# EAGLE board MBot (EAGLE 6.2), part 1 of 2
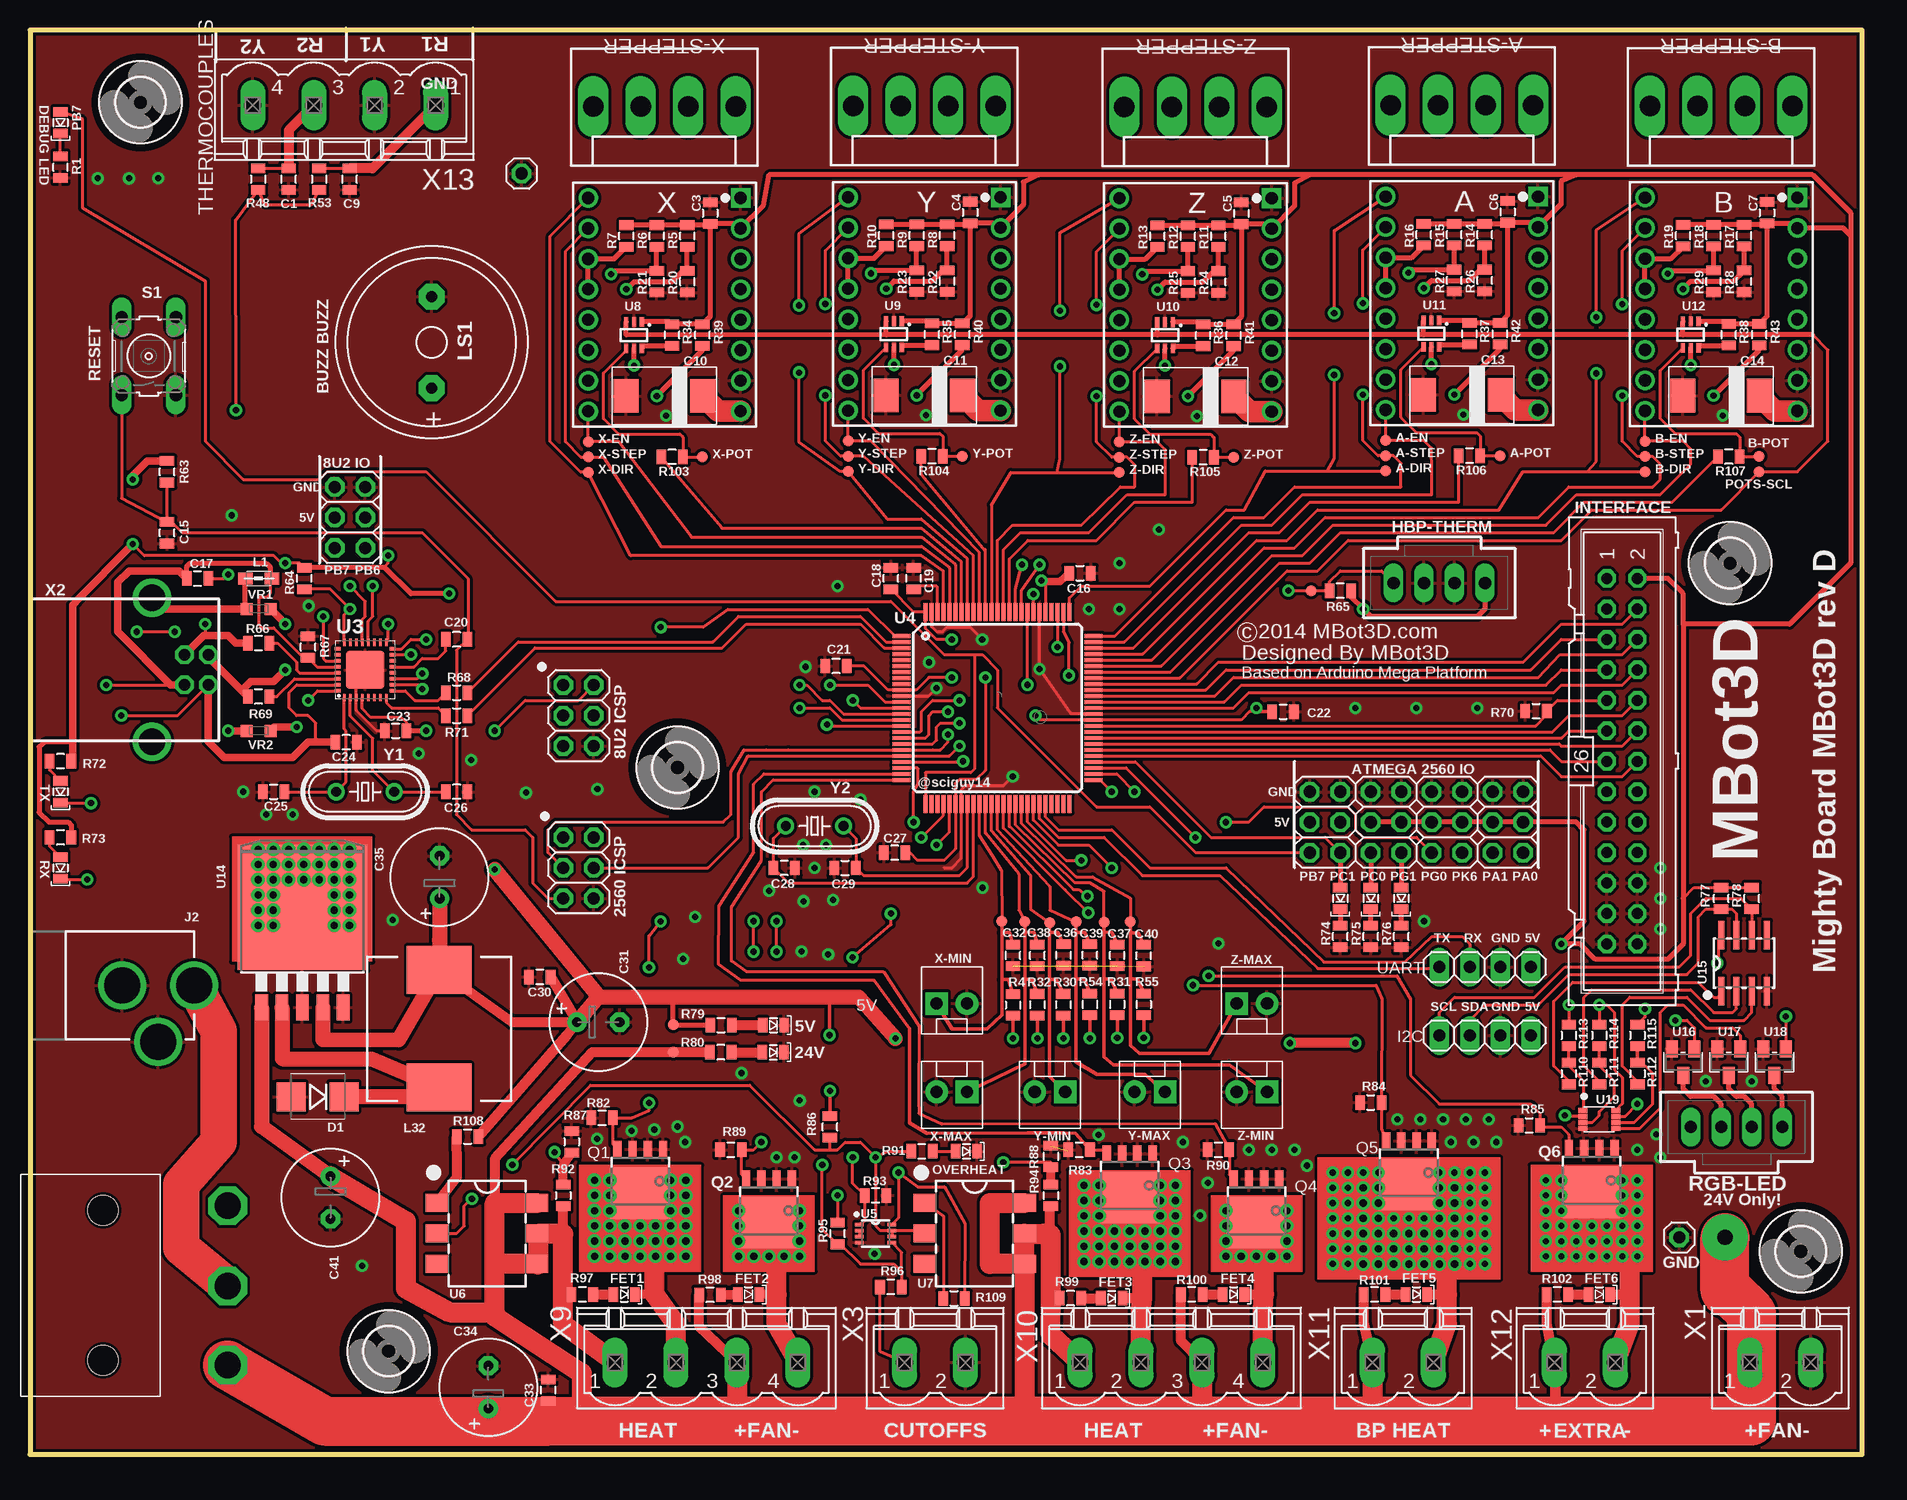
[diagram p2: board, top side]
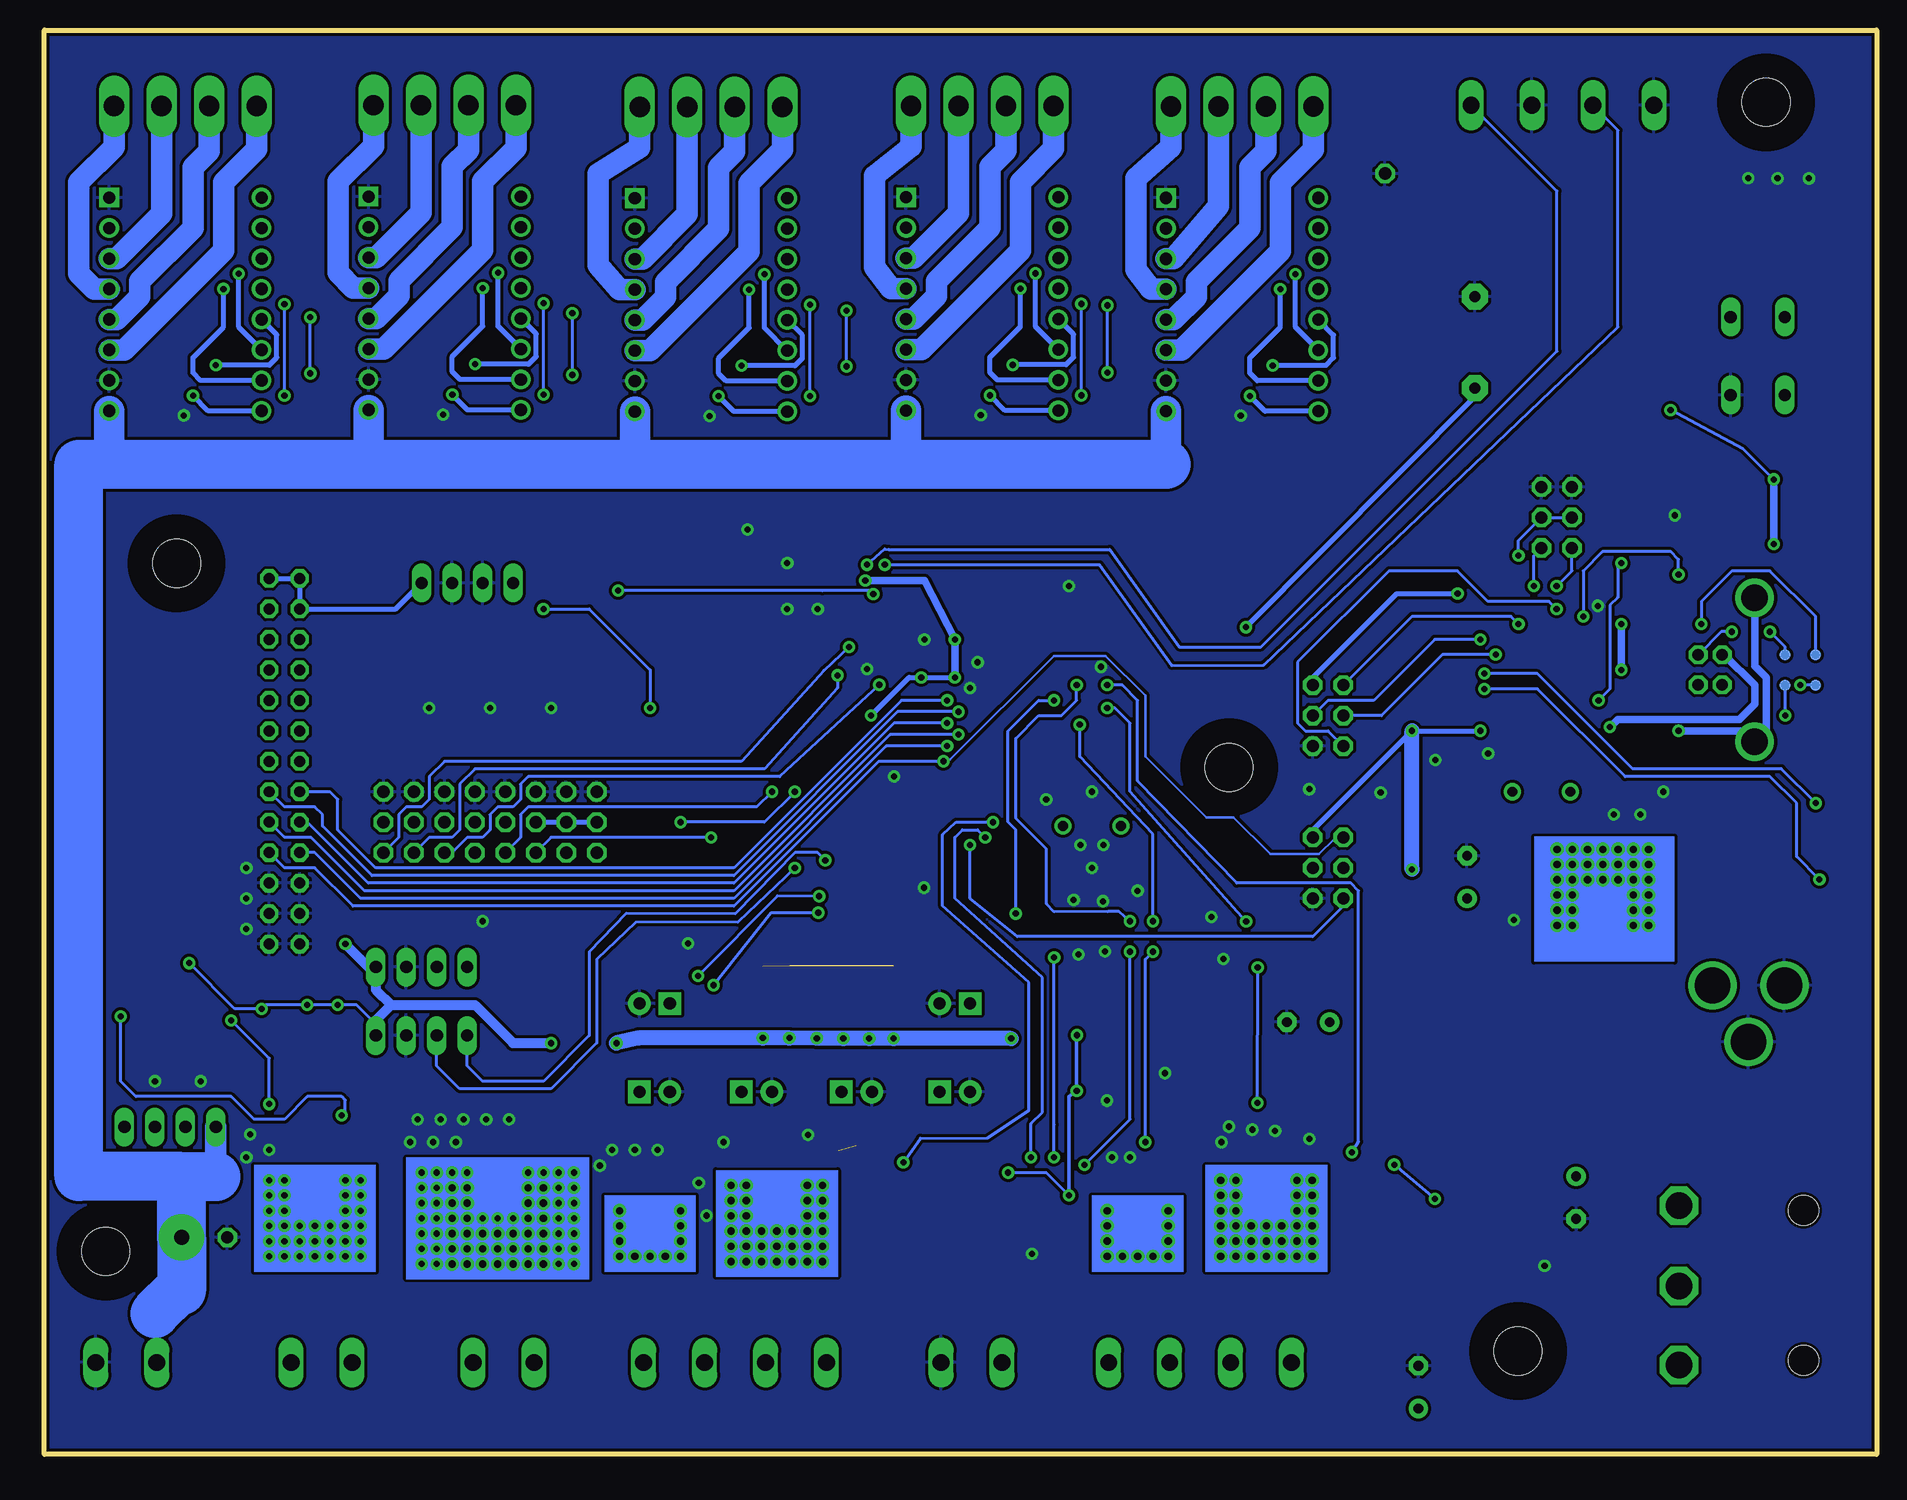
[diagram p3: board, bottom side, seen from below]

Size 152.72 x 118.75 mm. Coordinates in mm from the lower left corner, seen from the top.
Outline: 0,0 152.72,0 152.72,118.74 0,118.74 0,0
Copper layers (1*16): Top 0.035mm / dielectric 1.5mm / Bottom 0.035mm
Design rules: minimum track width 8mil, minimum drill 20mil, track to track 4mil, track to pad 4mil, pad to pad 4mil, via to via 4mil, smd to smd 0mil, copper to edge 10mil, drill to drill 8mil, minimum pad ring 12mil, minimum via ring 10mil, stop-mask expansion 4mil, vias tented up to drill 25mil, thermal gap 10mil
Net classes: 0 default: width 0.203 mm, drill 0.508 mm, clearance 0.203 mm; 1 24V: width 0.889 mm, drill 0.635 mm, clearance 0.508 mm; 2 gnd: width 0.381 mm, drill 0.508 mm, clearance 0.254 mm; 3 5V: width 0.381 mm, drill 0.508 mm, clearance 0.254 mm; 4 3.3V: width 0.381 mm, drill 0.508 mm, clearance 0.254 mm; 5 DC Motor: width 0.762 mm, drill 0.635 mm, clearance 0.254 mm

## Footprints (pad centres in the part's own frame; a part is rotated, then mirrored left to right if it is on the bottom)
LED-0805 = smd 1.2 x 0.8: A 0,-0.9; C 0,0.9
TP09R = smd 0.9 x 0.9: TP 0,0
KK-156-4 = drill 1.7 pad 2.184 long: 1 -5.94,0; 2 -1.98,0; 3 1.98,0; 4 5.94,0
BOTSTEP17-INV = drill 1.016 square: 1 6.35,8.89 | drill 1.016: 2 6.35,6.35; 3 6.35,3.81; 4 6.35,1.27; 5 6.35,-1.27; 6 6.35,-3.81; 7 6.35,-6.35; 8 6.35,-8.89; 9 -6.35,-8.89; 10 -6.35,-6.35; 11 -6.35,-3.81; 12 -6.35,-1.27; 13 -6.35,1.27; 14 -6.35,3.81; 15 -6.35,6.35; 16 -6.35,8.89
0805 = smd 0.8 x 1.2: 1 -0.9,0; 2 0.9,0
CAP2917 = smd 2.1 x 2.8: 1 -3.2,0; 2 3.2,0
E3,5-8 = drill 0.813 pad 1.6: + -1.778,0 | drill 0.813 pad 1.6 octagon: - 1.778,0
SMB-DIODE = smd 2.4 x 2.4: A 2.2,0; C -2.2,0
4,0HOLE-3,0KEEPOUT = hole 4: 0,0
70543-04 = drill 1.016 long: 1 -3.81,0; 2 -1.27,0; 3 1.27,0; 4 3.81,0
1X04 = drill 1.016 long: 1 -3.81,0; 2 -1.27,0; 3 1.27,0; 4 3.81,0
2X03 = drill 1.016 octagon: 1 -2.54,-1.27; 2 -2.54,1.27; 3 0,-1.27; 4 0,1.27; 5 2.54,-1.27; 6 2.54,1.27
ML26 = drill 0.914 octagon: 1 -15.24,-1.27; 2 -15.24,1.27; 3 -12.7,-1.27; 4 -12.7,1.27; 5 -10.16,-1.27; 6 -10.16,1.27; 7 -7.62,-1.27; 8 -7.62,1.27; 9 -5.08,-1.27; 10 -5.08,1.27; 11 -2.54,-1.27; 12 -2.54,1.27; 13 0,-1.27; 14 0,1.27; 15 2.54,-1.27; 16 2.54,1.27; 17 5.08,-1.27; 18 5.08,1.27; 19 7.62,-1.27; 20 7.62,1.27; 21 10.16,-1.27; 22 10.16,1.27; 23 12.7,-1.27; 24 12.7,1.27; 25 15.24,-1.27; 26 15.24,1.27
POWER_JACK_PTH = drill 2.997: GND 0,7.7; GNDBREAK 4.7,10.7; PWR 0,13.7
MOLEX-1X2 = drill 1.016 pad 1.88 square: 1 0,0 | drill 1.016 pad 1.88: 2 2.54,0
1X01 = drill 1.016 octagon: 1 0,0
0805' = smd 1.2 x 1: 1 -1.1,0; 2 1.1,0
CDRH125 = smd 5.4 x 4: 1 0,4.9; 2 0,-4.9
F/QMB = drill 0.914 pad 2.159 octagon: + 3.81,0; - -3.81,0
SOT669 = smd 0.7 x 1.4: 1 -1.905,-3.92; 2 -0.635,-3.92; 3 0.635,-3.92; 4 1.905,-3.92 | smd 5 x 4.3: MB 0,-0.27
B3F-10XX = drill 1.016 long: 1 -3.251,2.261; 2 3.251,2.261; 3 -3.251,-2.261; 4 3.251,-2.261
SWITCH = drill 2.2 octagon: P$3 2.6,17.24; P$4 9.3,17.24; P$5 15.9,17.24 | hole 2.5: 3,6.85; 15.491,6.85
QFN32 = smd 0.6 x 0.3: 1 -2.3,1.75; 2 -2.3,1.25; 3 -2.3,0.75; 4 -2.3,0.25; 5 -2.3,-0.25; 6 -2.3,-0.75; 7 -2.3,-1.25; 8 -2.3,-1.75; 17 2.3,-1.75; 18 2.3,-1.25; 19 2.3,-0.75; 20 2.3,-0.25; 21 2.3,0.25; 22 2.3,0.75; 23 2.3,1.25; 24 2.3,1.75 | smd 0.3 x 0.6: 9 -1.75,-2.3; 10 -1.25,-2.3; 11 -0.75,-2.3; 12 -0.25,-2.3; 13 0.25,-2.3; 14 0.75,-2.3; 15 1.25,-2.3; 16 1.75,-2.3; 25 1.75,2.3; 26 1.25,2.3; 27 0.75,2.3; 28 0.25,2.3; 29 -0.25,2.3; 30 -0.75,2.3; 31 -1.25,2.3; 32 -1.75,2.3 | smd 3.2 x 3.2: EXP 0,0
TQFP100 = smd 1.5 x 0.35: 1 -8,6; 2 -8,5.5; 3 -8,5; 4 -8,4.5; 5 -8,4; 6 -8,3.5; 7 -8,3; 8 -8,2.5; 9 -8,2; 10 -8,1.5; 11 -8,1; 12 -8,0.5; 13 -8,0; 14 -8,-0.5; 15 -8,-1; 16 -8,-1.5; 17 -8,-2; 18 -8,-2.5; 19 -8,-3; 20 -8,-3.5; 21 -8,-4; 22 -8,-4.5; 23 -8,-5; 24 -8,-5.5; 25 -8,-6; 51 8,-6; 52 8,-5.5; 53 8,-5; 54 8,-4.5; 55 8,-4; 56 8,-3.5; 57 8,-3; 58 8,-2.5; 59 8,-2; 60 8,-1.5; 61 8,-1; 62 8,-0.5; 63 8,0; 64 8,0.5; 65 8,1; 66 8,1.5; 67 8,2; 68 8,2.5; 69 8,3; 70 8,3.5; 71 8,4; 72 8,4.5; 73 8,5; 74 8,5.5; 75 8,6 | smd 0.35 x 1.5: 26 -6,-8; 27 -5.5,-8; 28 -5,-8; 29 -4.5,-8; 30 -4,-8; 31 -3.5,-8; 32 -3,-8; 33 -2.5,-8; 34 -2,-8; 35 -1.5,-8; 36 -1,-8; 37 -0.5,-8; 38 0,-8; 39 0.5,-8; 40 1,-8; 41 1.5,-8; 42 2,-8; 43 2.5,-8; 44 3,-8; 45 3.5,-8; 46 4,-8; 47 4.5,-8; 48 5,-8; 49 5.5,-8; 50 6,-8; 76 6,8; 77 5.5,8; 78 5,8; 79 4.5,8; 80 4,8; 81 3.5,8; 82 3,8; 83 2.5,8; 84 2,8; 85 1.5,8; 86 1,8; 87 0.5,8; 88 0,8; 89 -0.5,8; 90 -1,8; 91 -1.5,8; 92 -2,8; 93 -2.5,8; 94 -3,8; 95 -3.5,8; 96 -4,8; 97 -4.5,8; 98 -5,8; 99 -5.5,8; 100 -6,8
US8 = smd 0.3 x 0.7: 1 -0.75,-1.35; 2 -0.25,-1.35; 3 0.25,-1.35; 4 0.75,-1.35; 5 0.75,1.35; 6 0.25,1.35; 7 -0.25,1.35; 8 -0.75,1.35
AQV25-DIPSM = smd 1.5 x 1.9: 1 -2.54,-4.15; 2 0,-4.15; 3 2.54,-4.15; 4 2.54,4.15; 5 0,4.15; 6 -2.54,4.15
SC70-6L = smd 0.35 x 0.8: 1 -0.65,-1.1; 2 0,-1.1; 3 0.65,-1.1; 4 0.65,1.1; 5 0,1.1; 6 -0.65,1.1
TO263-5 = smd 1.067 x 2.159: 1 -3.404,-5.791; 2 -1.702,-5.791; 3 0,-5.791; 4 1.702,-5.791; 5 3.404,-5.791 | smd 10.8 x 10.41: 6 0,2.54
SO8 = smd 0.5 x 2.388: 1 -1.905,-2.324; 2 -0.635,-2.324; 3 0.635,-2.324; 4 1.905,-2.324; 5 1.905,2.324; 6 0.635,2.324; 7 -0.635,2.324; 8 -1.905,2.324
SOT-23 = smd 1 x 1.4: 1 -0.95,-1.1; 2 0.95,-1.1; 3 0,1.1
VSSOP8 = smd 0.4 x 0.75: 1 -0.75,-1.375; 2 -0.25,-1.375; 3 0.25,-1.375; 4 0.75,-1.375; 5 0.75,1.375; 6 0.25,1.375; 7 -0.25,1.375; 8 -0.75,1.375
CT/CN0603 = smd 1 x 1: 1 -1,0; 2 1,0
MSTBV2 = drill 1.397 long: 1 -2.54,0; 2 2.54,0
SMARTPRJ_PN61729 = drill 0.95 octagon: 1 1.25,4.71; 2 -1.25,4.71; 3 -1.25,2.71; 4 1.25,2.71 | drill 2.2: P$1 -6,0; P$2 6,0
MSTBV4 = drill 1.397 long: 1 -7.62,0; 2 -2.54,0; 3 2.54,0; 4 7.62,0
HC49/S = drill 0.813: 1 -2.413,0; 2 2.413,0

## Placement (x,y rotation side)
5V  GREEN  [LED-0805]  61.97,35.79 270 top
24V  GREEN  [LED-0805]  61.95,33.53 270 top
A-DIR  TPSQTP09R  [TP09R]  113,81.99 0 top
A-EN  TPSQTP09R  [TP09R]  113,84.53 0 top
A-POT  TPSQTP09R  [TP09R]  122.53,83.26 0 top
A-STEP  TPSQTP09R  [TP09R]  113,83.26 0 top
A-STEPPER  [KK-156-4]  119.35,112.47 180 top
B-DIR  TPSQTP09R  [TP09R]  134.62,81.92 0 top
B-EN  TPSQTP09R  [TP09R]  134.62,84.45 0 top
B-POT  TPSQTP09R  [TP09R]  144.14,83.19 0 top
B-STEP  TPSQTP09R  [TP09R]  134.62,83.19 0 top
B-STEPPER  [KK-156-4]  140.97,112.4 180 top
BOTSTEP-A  BOTSTEP17  [BOTSTEP17-INV]  119.35,95.96 0 top
BOTSTEP-B  BOTSTEP17  [BOTSTEP17-INV]  140.97,95.89 0 top
BOTSTEP-X  BOTSTEP17  [BOTSTEP17-INV]  52.88,95.86 0 top
BOTSTEP-Y  BOTSTEP17  [BOTSTEP17-INV]  74.55,95.91 0 top
BOTSTEP-Z  BOTSTEP17  [BOTSTEP17-INV]  97.16,95.83 0 top
C1  10uF  [0805]  21.56,106.31 90 top
C3  100nF  [0805]  56.69,103.48 270 top
C4  100nF  [0805]  78.36,103.53 270 top
C5  100nF  [0805]  100.97,103.45 270 top
C6  100nF  [0805]  123.16,103.58 270 top
C7  100nF  [0805]  144.78,103.51 270 top
C9  10uF  [0805]  26.64,106.31 90 top
C10  47uF  [CAP2917]  52.88,88.24 180 top
C11  47uF  [CAP2917]  74.55,88.29 180 top
C12  47uF  [CAP2917]  97.16,88.21 180 top
C13  47uF  [CAP2917]  119.35,88.34 180 top
C14  47uF  [CAP2917]  140.97,88.27 180 top
C15  22pF  [0805]  11.43,76.84 90 top
C16  100nF  [0805]  87.53,73.47 0 top
C17  1uF  [0805]  13.97,73.03 0 top
C18  100nF  [0805]  71.76,73.03 90 top
C19  100nF  [0805]  73.66,73.03 90 top
C20  100nF  [0805]  35.56,67.95 180 top
C21  100nF  [0805]  67.18,65.72 180 top
C22  100nF  [0805]  104.46,61.91 0 top
C23  100nF  [0805]  30.48,60.32 0 top
C24  100nF  [0805]  26.35,59.37 180 top
C25  22pF  [0805]  20.32,55.24 0 top
C26  22pF  [0805]  35.56,55.24 180 top
C27  100nF  [0805]  72.07,50.16 180 top
C28  22pF  [0805]  62.86,48.89 180 top
C29  22pF  [0805]  67.95,48.89 0 top
C30  100nF  [0805]  42.49,39.8 180 top
C31  100uF  [E3,5-8]  47.37,36.04 0 top
C32  100nF  [0805]  81.94,41.61 90 top
C33  100nF  [0805]  43.19,5.36 90 top
C34  100uF  [E3,5-8]  38.2,5.6 90 top
C35  220uF  [E3,5-8]  34.14,48.13 90 top
C36  100nF  [0805]  86.16,41.63 90 top
C37  100nF  [0805]  90.63,41.61 90 top
C38  100nF  [0805]  83.97,41.61 90 top
C39  100nF  [0805]  88.34,41.63 90 top
C40  100nF  [0805]  92.84,41.58 90 top
C41  680uF  [E3,5-8]  25.04,21.41 270 top
D1  [SMB-DIODE]  23.98,29.82 180 top
DEBUG1  GREEN  [LED-0805]  2.54,111.02 180 top
DEBUG2  GREEN  [LED-0805]  109.22,46.35 180 top
DEBUG3  GREEN  [LED-0805]  111.76,46.35 180 top
DEBUG4  GREEN  [LED-0805]  114.3,46.35 180 top
FET1  GREEN  [LED-0805]  49.53,13.33 270 top
FET2  GREEN  [LED-0805]  59.89,13.33 270 top
FET3  GREEN  [LED-0805]  90.17,13.03 270 top
FET4  GREEN  [LED-0805]  100.33,13.33 270 top
FET5  GREEN  [LED-0805]  115.57,13.33 270 top
FET6  GREEN  [LED-0805]  130.81,13.33 270 top
H1  [4,0HOLE-3,0KEEPOUT]  29.9,8.61 0 top
H2  [4,0HOLE-3,0KEEPOUT]  141.7,74.3 0 top
H3  [4,0HOLE-3,0KEEPOUT]  9.21,112.71 0 top
H4  [4,0HOLE-3,0KEEPOUT]  147.61,16.93 0 top
H5  [4,0HOLE-3,0KEEPOUT]  53.97,57.28 0 top
HBP-THERM  C-GRID-04-70543  [70543-04]  117.48,72.64 180 top
I2C  DNP  [1X04]  121.29,34.92 180 top
ICSP1  8U2-ICSP-DNP  [2X03]  45.72,61.59 270 top
ICSP2  ATMEGA-ICSP-DNP  [2X03]  45.72,48.89 270 top
INTERFACE  [ML26]  132.72,57.78 270 top
J2  POWER_JACKPTH  [POWER_JACK_PTH]  -0.03,39.09 270 top
JP1  [MOLEX-1X2]  75.56,37.59 0 top
JP2  DNP  [1X01]  40.97,106.78 0 top
JP3  DNP  [2X03]  26.67,78.11 270 top
JP4  DNP  [2X03]  107.95,52.7 270 top
JP5  DNP  [2X03]  113.03,52.7 270 top
JP6  DNP  [2X03]  118.11,52.7 270 top
JP7  DNP  [2X03]  123.19,52.7 270 top
JP8  DNP  [1X01]  137.48,18.1 0 top
JP9  [MOLEX-1X2]  86.28,30.23 180 top
JP10  [MOLEX-1X2]  103.12,30.23 180 top
JP11  [MOLEX-1X2]  78.11,30.23 180 top
JP12  [MOLEX-1X2]  94.62,30.23 180 top
JP13  [MOLEX-1X2]  100.58,37.59 0 top
L1  BLM21  [0805']  19.05,73.03 180 top
L32  33uH  [CDRH125]  34.11,35.48 180 top
LS1  F/QMB  [F/QMB]  33.48,92.71 270 top
OVERHEAT  RED  [LED-0805]  78.05,25.27 270 top
POTS-SCL  TPSQTP09R  [TP09R]  144.14,81.92 0 top
Q1  PSMN7R0-30YL  [SOT669]  50.86,21.51 180 top
Q2  PSMN7R0-30YL  [SOT669]  61.59,19.05 180 top
Q3  PSMN7R0-30YL  [SOT669]  91.67,21.16 180 top
Q4  PSMN7R0-30YL  [SOT669]  102.23,19.05 180 top
Q5  PSMN7R0-30YL  [SOT669]  114.94,22.23 180 top
Q6  PSMN7R0-30YL  [SOT669]  130.17,21.59 180 top
R1  1K  [0805]  2.54,107.32 90 top
R4  10K  [0805]  81.94,37.46 270 top
R5  0  [0805]  54.79,101.57 90 top
R6  0  [0805]  52.25,101.57 90 top
R7  10K  [0805]  49.71,101.57 90 top
R8  0  [0805]  76.45,101.63 90 top
R9  0  [0805]  73.91,101.63 90 top
R10  10K  [0805]  71.37,101.63 90 top
R11  0  [0805]  99.06,101.55 90 top
R12  0  [0805]  96.52,101.55 90 top
R13  10K  [0805]  93.98,101.55 90 top
R14  0  [0805]  121.26,101.68 90 top
R15  0  [0805]  118.72,101.68 90 top
R16  10K  [0805]  116.18,101.68 90 top
R17  0  [0805]  142.88,101.6 90 top
R18  0  [0805]  140.33,101.6 90 top
R19  10K  [0805]  137.79,101.6 90 top
R20  DNP  [0805]  54.79,97.76 90 top
R21  DNP  [0805]  52.25,97.76 90 top
R22  DNP  [0805]  76.45,97.82 90 top
R23  DNP  [0805]  73.91,97.82 90 top
R24  DNP  [0805]  99.06,97.74 90 top
R25  DNP  [0805]  96.52,97.74 90 top
R26  DNP  [0805]  121.26,97.87 90 top
R27  DNP  [0805]  118.72,97.87 90 top
R28  DNP  [0805]  142.88,97.79 90 top
R29  DNP  [0805]  140.33,97.79 90 top
R30  10K  [0805]  86.13,37.49 270 top
R31  10K  [0805]  90.63,37.52 270 top
R32  10K  [0805]  83.97,37.49 270 top
R34  10K  [0805]  53.52,93.32 90 top
R35  10K  [0805]  75.18,93.37 90 top
R36  10K  [0805]  97.79,93.29 90 top
R37  10K  [0805]  119.99,93.42 90 top
R38  10K  [0805]  141.6,93.34 90 top
R39  4.7K  [0805]  56.06,93.32 90 top
R40  4.7K  [0805]  77.72,93.37 90 top
R41  4.7K  [0805]  100.33,93.29 90 top
R42  4.7K  [0805]  122.53,93.42 90 top
R43  4.7K  [0805]  144.14,93.34 90 top
R48  4.7K  [0805]  19.02,106.31 270 top
R53  4.7K  [0805]  24.1,106.31 270 top
R54  10K  [0805]  88.34,37.52 270 top
R55  10K  [0805]  92.84,37.52 270 top
R63  10K  [0805]  11.43,81.92 90 top
R64  10K  [0805]  22.86,73.03 90 top
R65  100K  [0805]  109.22,72.01 180 top
R66  22  [0805]  19.05,67.63 180 top
R67  0  [0805]  23.18,67.31 90 top
R68  1K  [0805]  35.56,63.5 0 top
R69  22  [0805]  19.05,63.18 180 top
R70  10K  [0805]  125.54,61.98 0 top
R71  1K  [0805]  35.56,61.59 0 top
R72  1K  [0805]  2.54,57.78 180 top
R73  1K  [0805]  2.54,51.43 180 top
R74  1K  [0805]  109.22,43.18 90 top
R75  1K  [0805]  111.76,43.18 90 top
R76  1K  [0805]  114.3,43.18 90 top
R77  4.7K  [0805]  140.97,46.35 90 top
R78  4.7K  [0805]  143.51,46.35 90 top
R79  1K  [0805]  57.6,35.79 0 top
R80  2.21K  [0805]  57.58,33.53 180 top
R82  4.7K  [0805]  47.69,28.07 0 top
R83  4.7K  [0805]  87.45,25.4 0 top
R84  4.7K  [0805]  111.76,29.34 0 top
R85  4.7K  [0805]  124.97,27.43 0 top
R86  10k  [0805]  66.68,27.3 90 top
R87  2.21K  [0805]  45.16,26.06 270 top
R88  2.21K  [0805]  85.09,24.84 270 top
R89  4.7K  [0805]  58.42,25.4 0 top
R90  4.7K  [0805]  99.06,25.4 0 top
R91  1K  [0805]  74.35,25.27 0 top
R92  10k  [0805]  44.45,21.59 270 top
R93  10k  [0805]  70.48,21.59 180 top
R94  10k  [0805]  85.09,21.59 270 top
R95  10k  [0805]  67.31,18.42 90 top
R96  499  [0805]  71.76,13.97 180 top
R97  2.21K  [0805]  46.04,13.33 180 top
R98  2.21K  [0805]  56.68,13.31 180 top
R99  2.21K  [0805]  86.73,13.03 180 top
R100  2.21K  [0805]  96.84,13.33 180 top
R101  2.21K  [0805]  112.08,13.33 180 top
R102  2.21K  [0805]  127.32,13.33 180 top
R103  1K  [0805]  53.52,83.16 180 top
R104  1K  [0805]  75.18,83.21 180 top
R105  1K  [0805]  97.79,83.13 180 top
R106  1K  [0805]  119.99,83.26 180 top
R107  1K  [0805]  141.6,83.19 180 top
R108  4.7K  [0805]  36.47,26.49 0 top
R109  4.7K  [0805]  77.01,13 0 top
R110  100K  [0805]  128.27,31.75 270 top
R111  100K  [0805]  130.81,31.75 270 top
R112  100K  [0805]  133.98,31.75 270 top
R113  1M  [0805]  128.27,34.92 270 top
R114  1M  [0805]  130.81,34.92 270 top
R115  1M  [0805]  133.98,34.92 270 top
RGB-LED  C-GRID-04-70543  [70543-04]  142.24,27.3 0 top
RX  GREEN  [LED-0805]  2.54,48.89 180 top
S1  [B3F-10XX]  9.91,91.57 90 top
S2  SWITCH  [SWITCH]  -0.76,23.34 270 top
TP27  TPSQTP09R  [TP09R]  106.81,72.01 0 top
TP28  TPSQTP09R  [TP09R]  81,44.45 0 top
TP29  TPSQTP09R  [TP09R]  82.93,44.4 0 top
TP30  TPSQTP09R  [TP09R]  84.99,44.32 0 top
TP31  TPSQTP09R  [TP09R]  87.2,44.4 0 top
TP32  TPSQTP09R  [TP09R]  89.54,44.37 0 top
TP33  TPSQTP09R  [TP09R]  91.72,44.4 0 top
TP34  TPSQTP09R  [TP09R]  53.64,35.84 90 top
TP35  TPSQTP09R  [TP09R]  53.64,33.53 90 top
TX  GREEN  [LED-0805]  2.54,55.24 180 top
U3  ATMEGA8U2-MU  [QFN32]  27.94,65.41 90 top
U4  ATMEGA2560-16AU  [TQFP100]  80.65,62.23 0 top
U5  NC7WZ02  [US8]  70.48,18.42 270 top
U6  AQV25  [AQV25-DIPSM]  38.1,18.42 270 top
U7  AQV25  [AQV25-DIPSM]  78.74,18.42 270 top
U8  MCP4018  [SC70-6L]  50.34,93.32 180 top
U9  MCP4018  [SC70-6L]  72.01,93.37 180 top
U10  MCP4018  [SC70-6L]  94.62,93.29 180 top
U11  MCP4018  [SC70-6L]  116.81,93.42 180 top
U12  MCP4018  [SC70-6L]  138.43,93.34 180 top
U14  [TO263-5]  22.71,43.05 0 top
U15  PCA9533  [SO8]  142.88,40.96 0 top
U16  FDV301N  [SOT-23]  137.79,32.7 180 top
U17  FDV301N  [SOT-23]  141.6,32.7 180 top
U18  FDV301N  [SOT-23]  145.41,32.7 180 top
U19  74HC3G14DC  [VSSOP8]  130.81,27.94 270 top
UART  DNP  [1X04]  121.29,40.64 180 top
UGND  TPSQTP09R  [TP09R]  5.08,64.14 0 bottom
USB+  TPSQTP09R  [TP09R]  5.08,66.68 0 bottom
USB-  TPSQTP09R  [TP09R]  7.62,66.68 0 bottom
UVCC  TPSQTP09R  [TP09R]  7.62,64.14 0 bottom
VR1  PGB1010604  [CT/CN0603]  19.05,70.48 0 top
VR2  PGB1010604  [CT/CN0603]  19.05,60.32 0 top
X1  MSTBV2  [MSTBV2]  145.9,7.67 0 top
X2  [SMARTPRJ_PN61729]  10.16,65.41 270 top
X3  MSTBV2  [MSTBV2]  75.44,7.67 0 top
X9  MSTBV4  [MSTBV4]  56.39,7.67 0 top
X10  MSTBV4  [MSTBV4]  95.15,7.67 0 top
X11  MSTBV2  [MSTBV2]  114.45,7.67 0 top
X12  MSTBV2  [MSTBV2]  129.62,7.67 0 top
X13  MSTBV4  [MSTBV4]  26.19,112.47 180 top
X-DIR  TPSQTP09R  [TP09R]  46.53,81.89 0 top
X-EN  TPSQTP09R  [TP09R]  46.53,84.43 0 top
X-POT  TPSQTP09R  [TP09R]  56.06,83.16 0 top
X-STEP  TPSQTP09R  [TP09R]  46.53,83.16 0 top
X-STEPPER  [KK-156-4]  52.88,112.37 180 top
Y1  16MHz  [HC49/S]  27.94,55.24 0 top
Y2  16MHz  [HC49/S]  65.41,52.39 0 top
Y-DIR  TPSQTP09R  [TP09R]  68.2,81.94 0 top
Y-EN  TPSQTP09R  [TP09R]  68.2,84.48 0 top
Y-POT  TPSQTP09R  [TP09R]  77.72,83.21 0 top
Y-STEP  TPSQTP09R  [TP09R]  68.2,83.21 0 top
Y-STEPPER  [KK-156-4]  74.55,112.42 180 top
Z-DIR  TPSQTP09R  [TP09R]  90.81,81.86 0 top
Z-EN  TPSQTP09R  [TP09R]  90.81,84.4 0 top
Z-POT  TPSQTP09R  [TP09R]  100.33,83.13 0 top
Z-STEP  TPSQTP09R  [TP09R]  90.81,83.13 0 top
Z-STEPPER  [KK-156-4]  97.16,112.34 180 top